# Altium schematic sheet CPU_LPC1776_1.SchDoc: RFSoC AMC
size 420 x 297 mm; CmpIndex: 51; CompanyName: WUT; DrawnBy: T. Przywozki; Organization: WUT ISE; Address1: Warsaw University of Technology; Address2: Nowowiejska 15/19 00-665 Warsaw; Address3: Tomasz.Przywozki@pw.edu.pl; DocumentNumber: 28; Revision: 1; SheetNumber: 28; SheetTotal: 45; Project: RFSoC AMC; ModifiedBy: T. Przywozki; CreateDate: -; CheckedDate: -; DivGrp: ISE; Designer: T. Przywozki; ModifiedDate: -; ProjectName: ADC/DAC MEZZANINE
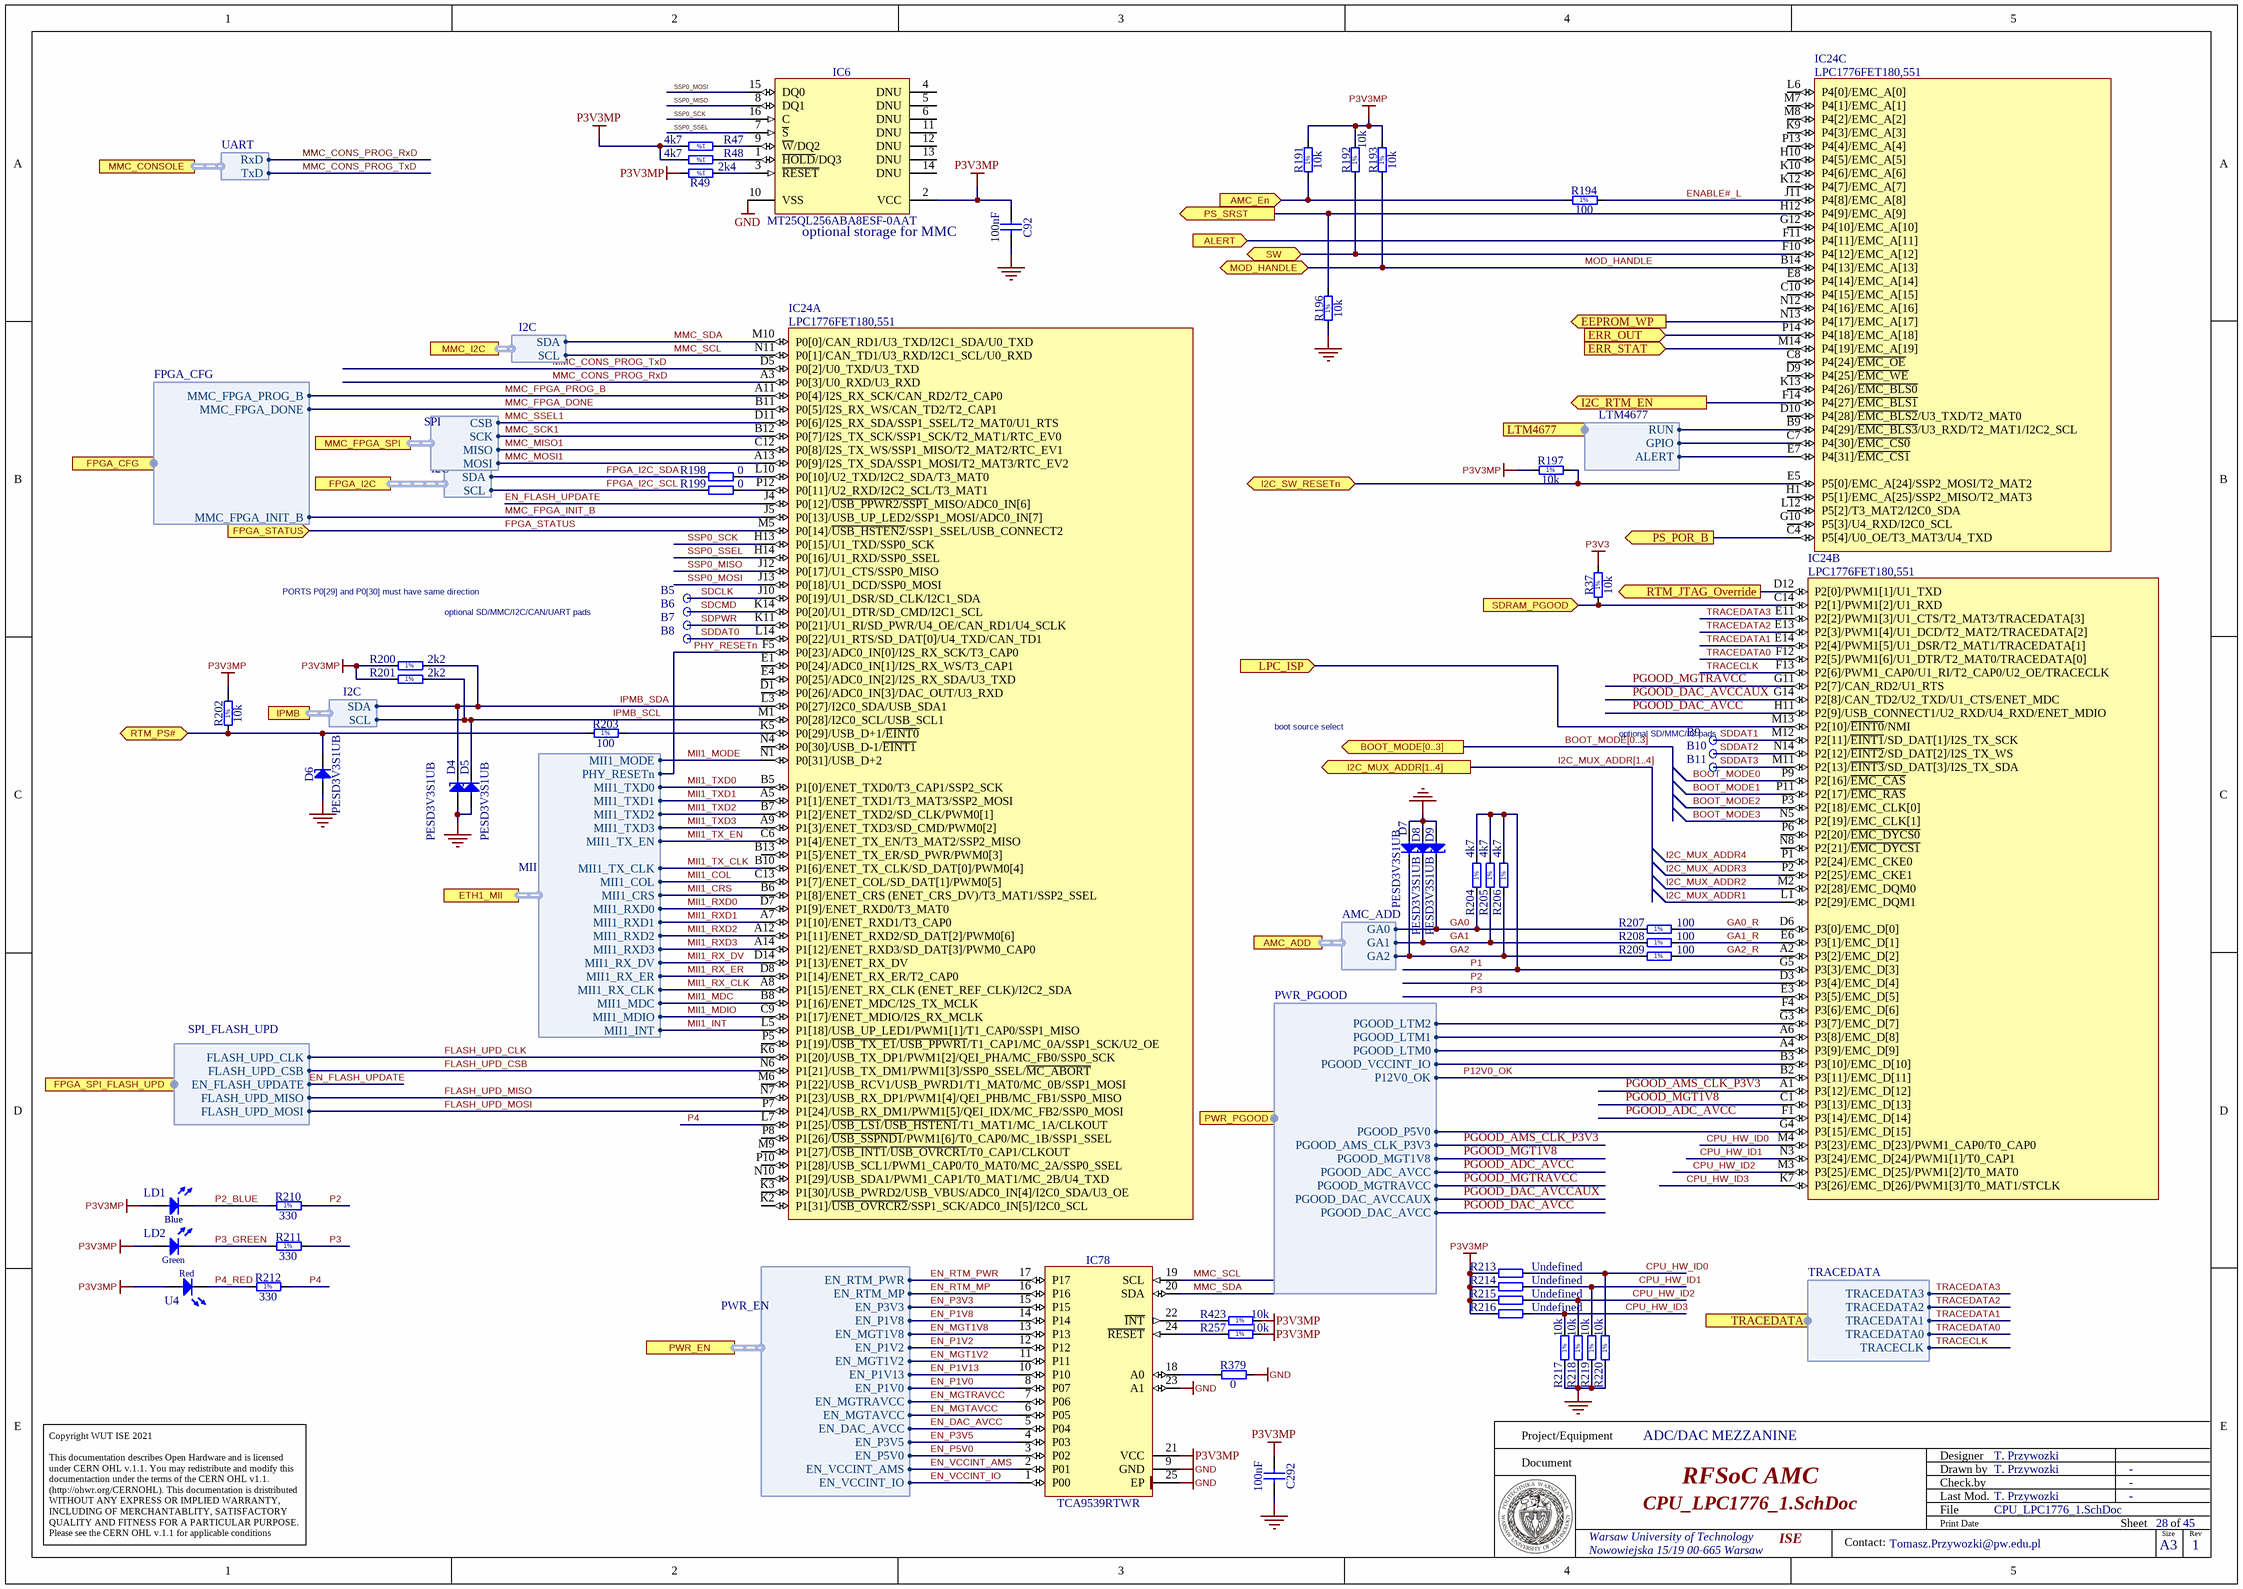
[diagram p0: CPU_LPC1776_1.SchDoc]

## Parts
B5  SMD_PAD_D1MM  [C100]  (value not drawn)
B6  SMD_PAD_D1MM  [C100]  (value not drawn)
B7  SMD_PAD_D1MM  [C100]  (value not drawn)
B8  SMD_PAD_D1MM  [C100]  (value not drawn)
B9  SMD_PAD_D1MM  [C100]  (value not drawn)
B10  SMD_PAD_D1MM  [C100]  (value not drawn)
B11  SMD_PAD_D1MM  [C100]  (value not drawn)
C92  100nF  [CAPC0603X33N]
C292  100nF  [CAPC0603X33N]
D4  PESD3V3S1UB  [SODFL1608X65N]
D5  PESD3V3S1UB  [SODFL1608X65N]
D6  PESD3V3S1UB  [SODFL1608X65N]
D7  PESD3V3S1UB  [SODFL1608X65N]
D8  PESD3V3S1UB  [SODFL1608X65N]
D9  PESD3V3S1UB  [SODFL1608X65N]
IC6  MT25QL256ABA8ESF-0AAT  [SOIC127P1030X265-16N]
IC24  LPC1776FET180,551  [BGA180C80P14X14_1200X1200X120]  (parts A,B,C of 5)
IC78  TCA9539RTWR  [QFN50P400X400X80-25N-S255]
LD1  Blue  [LED_AVAGO_HSMR-C120]
LD2  Green  [LED_AVAGO_HSME-C120]
R37  10k  [RESC1005X40N]
R47  4k7  [RESC1005X40N]
R48  4k7  [RESC1005X40N]
R49  2k4  [RESC1005X40N]
R191  10k  [RESC1005X40N]
R192  10k  [RESC1005X40N]
R193  10k  [RESC1005X40N]
R194  100  [RESC1005X40N]
R196  10k  [RESC1005X40N]
R197  10k  [RESC1005X40N]
R198  0  [RESC1005X40N]
R199  0  [RESC1005X40N]
R200  2k2  [RESC1005X40N]
R201  2k2  [RESC1005X40N]
R202  10k  [RESC1005X40N]
R203  100  [RESC1005X40N]
R204  4k7  [RESC1005X40N]
R205  4k7  [RESC1005X40N]
R206  4k7  [RESC1005X40N]
R207  100  [RESC1005X40N]
R208  100  [RESC1005X40N]
R209  100  [RESC1005X40N]
R210  330  [RESC1005X40N]
R211  330  [RESC1005X40N]
R212  330  [RESC1005X40N]
R213  Undefined  [RESC1005X40N]
R214  Undefined  [RESC1005X40N]
R215  Undefined  [RESC1005X40N]
R216  Undefined  [RESC1005X40N]
R217  10k  [RESC1005X40N]
R218  10k  [RESC1005X40N]
R219  10k  [RESC1005X40N]
R220  10k  [RESC1005X40N]
R257  10k  [RESC1005X40N]
R379  0  [RESC1005X40N]
R423  10k  [RESC1005X40N]
U4  Red  [LED_OSRAM_LS Q976]

## Ports
ALERT (in), AMC_ADD (harness AMC_ADD), AMC_En (in), BOOT_MODE[0..3] (out), EEPROM_WP (out), ERR_OUT (in), ERR_STAT (in), ETH1_MII (harness MII), FPGA_CFG (harness FPGA_CFG), FPGA_I2C (harness I2C), FPGA_SPI_FLASH_UPD (harness SPI_FLASH_UPD), FPGA_STATUS (in), I2C_MUX_ADDR[1..4] (out), I2C_RTM_EN (out), I2C_SW_RESETn (bidir), IPMB (harness I2C), LPC_ISP (in), LTM4677 (harness LTM4677), MMC_CONSOLE (harness UART), MMC_FPGA_SPI (harness SPI), MMC_I2C (harness I2C), MOD_HANDLE (bidir), PS_POR_B (out), PS_SRST (out), PWR_EN (harness PWR_EN), PWR_PGOOD (harness PWR_PGOOD), RTM_JTAG_Override (out), RTM_PS# (bidir), SDRAM_PGOOD (in), SW (bidir), TRACEDATA (harness TRACEDATA)

## Harnesses
I2C: SDA, SCL
MII: MII1_MODE, MII1_TXD0, MII1_TXD2, MII1_TXD3, MII1_TX_EN, MII1_TX_CLK, MII1_COL, MII1_CRS, MII1_RXD0, MII1_RXD1, MII1_RXD2, MII1_RXD3, MII1_RX_DV, MII1_RX_ER, MII1_RX_CLK, MII1_MDC, MII1_MDIO, MII1_INT, PHY_RESETn, MII1_TXD1
SPI: SCK, CSB, MISO, MOSI
FPGA_CFG: MMC_FPGA_PROG_B, MMC_FPGA_DONE, MMC_FPGA_INIT_B
AMC_ADD: GA0, GA1, GA2
SPI_FLASH_UPD: EN_FLASH_UPDATE, FLASH_UPD_MOSI, FLASH_UPD_MISO, FLASH_UPD_CSB, FLASH_UPD_CLK
PWR_PGOOD: PGOOD_AMS_CLK_P3V3, PGOOD_ADC_AVCC, PGOOD_MGT1V8, PGOOD_DAC_AVCCAUX, PGOOD_MGTRAVCC, PGOOD_DAC_AVCC, PGOOD_LTM0, PGOOD_LTM1, PGOOD_LTM2, P12V0_OK, PGOOD_P5V0, PGOOD_VCCINT_IO
PWR_EN: EN_MGTRAVCC, EN_MGT1V8, EN_DAC_AVCC, EN_P1V0, EN_P1V8, EN_P1V13, EN_MGT1V2, EN_P3V3, EN_P1V2, EN_P3V5, EN_MGTAVCC, EN_VCCINT_AMS, EN_RTM_PWR, EN_RTM_MP, EN_P5V0, EN_VCCINT_IO
LTM4677: GPIO, RUN, ALERT
UART: RxD, TxD
TRACEDATA: TRACEDATA3, TRACEDATA2, TRACEDATA1, TRACEDATA0, TRACECLK

## Nets
GND: C92.1 C292.1 D4.2(A) D5.2(A) D6.2(A) D7.2(A) D8.2(A) D9.2(A) IC6.10(VSS) IC78.9(GND) IC78.23(A1) IC78.25(EP) R196.1 R217.1 R218.1 R219.1 R220.1 R379.2
P3V3: R37.2
P3V3MP: C92.2 C292.2 IC6.2(VCC) IC78.21(VCC) LD1.2(A) LD2.2(A) R47.2 R48.2 R49.2 R191.2 R192.2 R193.2 R197.1 R200.1 R201.1 R202.2 R213.1 R214.1 R215.1 R216.1 R257.2 R423.2 U4.2(A)
ALERT: IC24.F11(P4[11]/EMC_A[11]) ; port ALERT
AMC_En: R191.1 R194.1 ; port AMC_En
BOOT_MODE0: IC24.P9(P2[16]/~{EMC_CAS})
BOOT_MODE1: IC24.P11(P2[17]/~{EMC_RAS})
BOOT_MODE2: IC24.P3(P2[18]/EMC_CLK[0])
BOOT_MODE3: IC24.N5(P2[19]/EMC_CLK[1])
CPU_HW_ID0: IC24.M4(P3[23]/EMC_D[23]/PWM1_CAP0/T0_CAP0) R213.2 R220.2
CPU_HW_ID1: IC24.N3(P3[24]/EMC_D[24]/PWM1[1]/T0_CAP1) R214.2 R219.2
CPU_HW_ID2: IC24.M3(P3[25]/EMC_D[25]/PWM1[2]/T0_MAT0) R215.2 R218.2
CPU_HW_ID3: IC24.K7(P3[26]/EMC_D[26]/PWM1[3]/T0_MAT1/STCLK) R216.2 R217.2
EEPROM_WP: IC24.N13(P4[17]/EMC_A[17]) ; port EEPROM_WP
EN_DAC_AVCC: IC78.5(P04) ; port PWR_EN.EN_DAC_AVCC
EN_FLASH_UPDATE: IC24.J4(P0[12]/~{USB_PPWR2/SSP1}_MISO/ADC0_IN[6]) ; port FPGA_SPI_FLASH_UPD.EN_FLASH_UPDATE
EN_MGT1V2: IC78.11(P11) ; port PWR_EN.EN_MGT1V2
EN_MGT1V8: IC78.13(P13) ; port PWR_EN.EN_MGT1V8
EN_MGTAVCC: IC78.6(P05) ; port PWR_EN.EN_MGTAVCC
EN_MGTRAVCC: IC78.7(P06) ; port PWR_EN.EN_MGTRAVCC
EN_P1V0: IC78.8(P07) ; port PWR_EN.EN_P1V0
EN_P1V2: IC78.12(P12) ; port PWR_EN.EN_P1V2
EN_P1V8: IC78.14(P14) ; port PWR_EN.EN_P1V8
EN_P1V13: IC78.10(P10) ; port PWR_EN.EN_P1V13
EN_P3V3: IC78.15(P15) ; port PWR_EN.EN_P3V3
EN_P3V5: IC78.4(P03) ; port PWR_EN.EN_P3V5
EN_P5V0: IC78.3(P02) ; port PWR_EN.EN_P5V0
EN_RTM_MP: IC78.16(P16) ; port PWR_EN.EN_RTM_MP
EN_RTM_PWR: IC78.17(P17) ; port PWR_EN.EN_RTM_PWR
EN_VCCINT_AMS: IC78.2(P01) ; port PWR_EN.EN_VCCINT_AMS
EN_VCCINT_IO: IC78.1(P00) ; port PWR_EN.EN_VCCINT_IO
ENABLE#_L: IC24.J11(P4[8]/EMC_A[8]) R194.2
ERR_OUT: IC24.P14(P4[18]/EMC_A[18]) ; port ERR_OUT
ERR_STAT: IC24.M14(P4[19]/EMC_A[19]) ; port ERR_STAT
FLASH_UPD_CLK: IC24.K6(P1[20]/USB_TX_DP1/PWM1[2]/QEI_PHA/MC_FB0/SSP0_SCK) ; port FPGA_SPI_FLASH_UPD.FLASH_UPD_CLK
FLASH_UPD_CSB: IC24.N6(P1[21]/USB_TX_DM1/PWM1[3]/SSP0_SSEL/~{MC_ABORT}) ; port FPGA_SPI_FLASH_UPD.FLASH_UPD_CSB
FLASH_UPD_MISO: IC24.N7(P1[23]/USB_RX_DP1/PWM1[4]/QEI_PHB/MC_FB1/SSP0_MISO) ; port FPGA_SPI_FLASH_UPD.FLASH_UPD_MISO
FLASH_UPD_MOSI: IC24.P7(P1[24]/USB_RX_DM1/PWM1[5]/QEI_IDX/MC_FB2/SSP0_MOSI) ; port FPGA_SPI_FLASH_UPD.FLASH_UPD_MOSI
FPGA_I2C_SCL: R199.1 ; port FPGA_I2C.SCL
FPGA_I2C_SDA: R198.1 ; port FPGA_I2C.SDA
FPGA_STATUS: IC24.M5(P0[14]/~{USB_HSTEN2}/SSP1_SSEL/USB_CONNECT2) ; port FPGA_STATUS
GA0: D9.1(C) R204.1 R207.1 ; port AMC_ADD.GA0
GA0_R: IC24.D6(P3[0]/EMC_D[0]) R207.2
GA1: D8.1(C) R205.1 R208.1 ; port AMC_ADD.GA1
GA1_R: IC24.E6(P3[1]/EMC_D[1]) R208.2
GA2: D7.1(C) R206.1 R209.1 ; port AMC_ADD.GA2
GA2_R: IC24.A2(P3[2]/EMC_D[2]) R209.2
I2C_MUX_ADDR1: IC24.L1(P2[29]/EMC_DQM1)
I2C_MUX_ADDR2: IC24.M2(P2[28]/EMC_DQM0)
I2C_MUX_ADDR3: IC24.P2(P2[25]/EMC_CKE1)
I2C_MUX_ADDR4: IC24.P1(P2[24]/EMC_CKE0)
I2C_RTM_EN: IC24.F14(P4[27]/~{EMC_BLS1}) ; port I2C_RTM_EN
I2C_SW_RESETn: IC24.E5(P5[0]/EMC_A[24]/SSP2_MOSI/T2_MAT2) R197.2 ; port I2C_SW_RESETn
IPMB_SCL: D5.1(C) IC24.M1(P0[28]/I2C0_SCL/USB_SCL1) R201.2 ; port IPMB.SCL
IPMB_SDA: D4.1(C) IC24.L3(P0[27]/I2C0_SDA/USB_SDA1) R200.2 ; port IPMB.SDA
LPC_ISP: IC24.M13(P2[10]/~{EINT0}/NMI) ; port LPC_ISP
MII1_COL: IC24.C13(P1[7]/ENET_COL/SD_DAT[1]/PWM0[5]) ; port ETH1_MII.MII1_COL
MII1_CRS: IC24.B6(P1[8]/ENET_CRS_(ENET_CRS_DV)/T3_MAT1/SSP2_SSEL) ; port ETH1_MII.MII1_CRS
MII1_INT: IC24.L5(P1[18]/USB_UP_LED1/PWM1[1]/T1_CAP0/SSP1_MISO) ; port ETH1_MII.MII1_INT
MII1_MDC: IC24.B8(P1[16]/ENET_MDC/I2S_TX_MCLK) ; port ETH1_MII.MII1_MDC
MII1_MDIO: IC24.C9(P1[17]/ENET_MDIO/I2S_RX_MCLK) ; port ETH1_MII.MII1_MDIO
MII1_MODE: IC24.N1(P0[31]/USB_D+2) ; port ETH1_MII.MII1_MODE
MII1_RX_CLK: IC24.A8(P1[15]/ENET_RX_CLK_(ENET_REF_CLK)/I2C2_SDA) ; port ETH1_MII.MII1_RX_CLK
MII1_RX_DV: IC24.D14(P1[13]/ENET_RX_DV) ; port ETH1_MII.MII1_RX_DV
MII1_RX_ER: IC24.D8(P1[14]/ENET_RX_ER/T2_CAP0) ; port ETH1_MII.MII1_RX_ER
MII1_RXD0: IC24.D7(P1[9]/ENET_RXD0/T3_MAT0) ; port ETH1_MII.MII1_RXD0
MII1_RXD1: IC24.A7(P1[10]/ENET_RXD1/T3_CAP0) ; port ETH1_MII.MII1_RXD1
MII1_RXD2: IC24.A12(P1[11]/ENET_RXD2/SD_DAT[2]/PWM0[6]) ; port ETH1_MII.MII1_RXD2
MII1_RXD3: IC24.A14(P1[12]/ENET_RXD3/SD_DAT[3]/PWM0_CAP0) ; port ETH1_MII.MII1_RXD3
MII1_TX_CLK: IC24.B10(P1[6]/ENET_TX_CLK/SD_DAT[0]/PWM0[4]) ; port ETH1_MII.MII1_TX_CLK
MII1_TX_EN: IC24.C6(P1[4]/ENET_TX_EN/T3_MAT2/SSP2_MISO) ; port ETH1_MII.MII1_TX_EN
MII1_TXD0: IC24.B5(P1[0]/ENET_TXD0/T3_CAP1/SSP2_SCK) ; port ETH1_MII.MII1_TXD0
MII1_TXD1: IC24.A5(P1[1]/ENET_TXD1/T3_MAT3/SSP2_MOSI) ; port ETH1_MII.MII1_TXD1
MII1_TXD2: IC24.B7(P1[2]/ENET_TXD2/SD_CLK/PWM0[1]) ; port ETH1_MII.MII1_TXD2
MII1_TXD3: IC24.A9(P1[3]/ENET_TXD3/SD_CMD/PWM0[2]) ; port ETH1_MII.MII1_TXD3
MMC_CONS_PROG_RxD: IC24.A3(P0[3]/U0_RXD/U3_RXD) ; port MMC_CONSOLE.RxD
MMC_CONS_PROG_TxD: IC24.D5(P0[2]/U0_TXD/U3_TXD) ; port MMC_CONSOLE.TxD
MMC_FPGA_DONE: IC24.B11(P0[5]/I2S_RX_WS/CAN_TD2/T2_CAP1) ; port FPGA_CFG.MMC_FPGA_DONE
MMC_FPGA_INIT_B: IC24.J5(P0[13]/USB_UP_LED2/SSP1_MOSI/ADC0_IN[7]) ; port FPGA_CFG.MMC_FPGA_INIT_B
MMC_FPGA_PROG_B: IC24.A11(P0[4]/I2S_RX_SCK/CAN_RD2/T2_CAP0) ; port FPGA_CFG.MMC_FPGA_PROG_B
MMC_MISO1: IC24.C12(P0[8]/I2S_TX_WS/SSP1_MISO/T2_MAT2/RTC_EV1) ; port MMC_FPGA_SPI.MISO
MMC_MOSI1: IC24.A13(P0[9]/I2S_TX_SDA/SSP1_MOSI/T2_MAT3/RTC_EV2) ; port MMC_FPGA_SPI.MOSI
MMC_SCK1: IC24.B12(P0[7]/I2S_TX_SCK/SSP1_SCK/T2_MAT1/RTC_EV0) ; port MMC_FPGA_SPI.SCK
MMC_SCL: IC24.N11(P0[1]/CAN_TD1/U3_RXD/I2C1_SCL/U0_RXD) IC78.19(SCL) ; port MMC_I2C.SCL
MMC_SDA: IC24.M10(P0[0]/CAN_RD1/U3_TXD/I2C1_SDA/U0_TXD) IC78.20(SDA) ; port MMC_I2C.SDA
MMC_SSEL1: IC24.D11(P0[6]/I2S_RX_SDA/SSP1_SSEL/T2_MAT0/U1_RTS) ; port MMC_FPGA_SPI.CSB
MOD_HANDLE: IC24.B14(P4[13]/EMC_A[13]) R193.1 ; port MOD_HANDLE
P1: IC24.G5(P3[3]/EMC_D[3]) R204.2 R205.2 R206.2
P2: IC24.D3(P3[4]/EMC_D[4]) R210.2
P2_BLUE: LD1.1(C) R210.1
P3: IC24.E3(P3[5]/EMC_D[5]) R211.2
P3_GREEN: LD2.1(C) R211.1
P4: IC24.L7(P1[25]/~{USB_LS1}/~{USB_HSTEN1}/T1_MAT1/MC_1A/CLKOUT) R212.2
P4_RED: R212.1 U4.1(C)
P12V0_OK: IC24.B2(P3[11]/EMC_D[11]) ; port PWR_PGOOD.P12V0_OK
PGOOD_ADC_AVCC: IC24.F1(P3[14]/EMC_D[14]) ; port PWR_PGOOD.PGOOD_ADC_AVCC
PGOOD_AMS_CLK_P3V3: IC24.A1(P3[12]/EMC_D[12]) ; port PWR_PGOOD.PGOOD_AMS_CLK_P3V3
PGOOD_DAC_AVCC: IC24.H11(P2[9]/USB_CONNECT1/U2_RXD/U4_RXD/ENET_MDIO) ; port PWR_PGOOD.PGOOD_DAC_AVCC
PGOOD_DAC_AVCCAUX: IC24.G14(P2[8]/CAN_TD2/U2_TXD/U1_CTS/ENET_MDC) ; port PWR_PGOOD.PGOOD_DAC_AVCCAUX
PGOOD_MGT1V8: IC24.C1(P3[13]/EMC_D[13]) ; port PWR_PGOOD.PGOOD_MGT1V8
PGOOD_MGTRAVCC: IC24.G11(P2[7]/CAN_RD2/U1_RTS) ; port PWR_PGOOD.PGOOD_MGTRAVCC
PHY_RESETn: IC24.F5(P0[23]/ADC0_IN[0]/I2S_RX_SCK/T3_CAP0) ; port ETH1_MII.PHY_RESETn
PS_POR_B: IC24.C4(P5[4]/U0_OE/T3_MAT3/U4_TXD) ; port PS_POR_B
PS_SRST: IC24.H12(P4[9]/EMC_A[9]) R196.2 ; port PS_SRST
RTM_JTAG_Override: IC24.D12(P2[0]/PWM1[1]/U1_TXD) ; port RTM_JTAG_Override
RTM_PS#: D6.1(C) R202.1 R203.1 ; port RTM_PS#
SDCLK: B5.1 IC24.J10(P0[19]/U1_DSR/SD_CLK/I2C1_SDA)
SDCMD: B6.1 IC24.K14(P0[20]/U1_DTR/SD_CMD/I2C1_SCL)
SDDAT0: B8.1 IC24.L14(P0[22]/U1_RTS/SD_DAT[0]/U4_TXD/CAN_TD1)
SDDAT1: B9.1 IC24.M12(P2[11]/~{EINT1}/SD_DAT[1]/I2S_TX_SCK)
SDDAT2: B10.1 IC24.N14(P2[12]/~{EINT2}/SD_DAT[2]/I2S_TX_WS)
SDDAT3: B11.1 IC24.M11(P2[13]/~{EINT3}/SD_DAT[3]/I2S_TX_SDA)
SDPWR: B7.1 IC24.K11(P0[21]/U1_RI/SD_PWR/U4_OE/CAN_RD1/U4_SCLK)
SDRAM_PGOOD: IC24.C14(P2[1]/PWM1[2]/U1_RXD) R37.1 ; port SDRAM_PGOOD
SSP0_MISO: IC6.8(DQ1) IC24.J12(P0[17]/U1_CTS/SSP0_MISO)
SSP0_MOSI: IC6.15(DQ0) IC24.J13(P0[18]/U1_DCD/SSP0_MOSI)
SSP0_SCK: IC6.16(C) IC24.H13(P0[15]/U1_TXD/SSP0_SCK)
SSP0_SSEL: IC6.7(~{S}) IC24.H14(P0[16]/U1_RXD/SSP0_SSEL)
SW: IC24.F10(P4[12]/EMC_A[12]) R192.1 ; port SW
TRACECLK: IC24.F13(P2[6]/PWM1_CAP0/U1_RI/T2_CAP0/U2_OE/TRACECLK) ; port TRACEDATA.TRACECLK
TRACEDATA0: IC24.F12(P2[5]/PWM1[6]/U1_DTR/T2_MAT0/TRACEDATA[0]) ; port TRACEDATA.TRACEDATA0
TRACEDATA1: IC24.E14(P2[4]/PWM1[5]/U1_DSR/T2_MAT1/TRACEDATA[1]) ; port TRACEDATA.TRACEDATA1
TRACEDATA2: IC24.E13(P2[3]/PWM1[4]/U1_DCD/T2_MAT2/TRACEDATA[2]) ; port TRACEDATA.TRACEDATA2
TRACEDATA3: IC24.E11(P2[2]/PWM1[3]/U1_CTS/T2_MAT3/TRACEDATA[3]) ; port TRACEDATA.TRACEDATA3
NetIC6_1: IC6.1(~{HOLD}/DQ3) R48.1
NetIC6_3: IC6.3(~{RESET}) R49.1
NetIC6_9: IC6.9(~{W}/DQ2) R47.1
NetIC24_A4: IC24.A4(P3[9]/EMC_D[9]) ; port PWR_PGOOD.PGOOD_LTM0
NetIC24_A6: IC24.A6(P3[8]/EMC_D[8]) ; port PWR_PGOOD.PGOOD_LTM1
NetIC24_B3: IC24.B3(P3[10]/EMC_D[10]) ; port PWR_PGOOD.PGOOD_VCCINT_IO
NetIC24_B9: IC24.B9(P4[29]/~{EMC_BLS3}/U3_RXD/T2_MAT1/I2C2_SCL) ; port LTM4677.RUN
NetIC24_C7: IC24.C7(P4[30]/~{EMC_CS0}) ; port LTM4677.GPIO
NetIC24_E7: IC24.E7(P4[31]/~{EMC_CS1}) ; port LTM4677.ALERT
NetIC24_G3: IC24.G3(P3[7]/EMC_D[7]) ; port PWR_PGOOD.PGOOD_LTM2
NetIC24_G4: IC24.G4(P3[15]/EMC_D[15]) ; port PWR_PGOOD.PGOOD_P5V0
NetIC24_K5: IC24.K5(P0[29]/USB_D+1/~{EINT0}) R203.2
NetIC24_L10: IC24.L10(P0[10]/U2_TXD/I2C2_SDA/T3_MAT0) R198.2
NetIC24_P12: IC24.P12(P0[11]/U2_RXD/I2C2_SCL/T3_MAT1) R199.2
NetIC78_18: IC78.18(A0) R379.1
NetIC78_22: IC78.22(~{INT}) R423.1
NetIC78_24: IC78.24(~{RESET}) R257.1

Not connected (* = marked no-connect by the designer): IC6 4(DNU) 5(DNU) 6(DNU) 11(DNU) 12(DNU) 13(DNU) 14(DNU); IC24 B13(P1[5]/ENET_TX_ER/SD_PWR/PWM0[3]) C8(P4[24]/~{EMC_OE}) C10(P4[15]/EMC_A[15]) D1(P0[26]/ADC0_IN[3]/DAC_OUT/U3_RXD) D9(P4[25]/~{EMC_WE}) D10(P4[28]/~{EMC_BLS2}/U3_TXD/T2_MAT0) E1(P0[24]/ADC0_IN[1]/I2S_RX_WS/T3_CAP1) E4(P0[25]/ADC0_IN[2]/I2S_RX_SDA/U3_TXD) E8(P4[14]/EMC_A[14]) F4(P3[6]/EMC_D[6]) G10(P5[3]/U4_RXD/I2C0_SCL) G12(P4[10]/EMC_A[10]) H1(P5[1]/EMC_A[25]/SSP2_MISO/T2_MAT3) H10(P4[5]/EMC_A[5]) K2(P1[31]/~{USB_OVRCR2}/SSP1_SCK/ADC0_IN[5]/I2C0_SCL) K3(P1[30]/USB_PWRD2/USB_VBUS/ADC0_IN[4]/I2C0_SDA/U3_OE) K9(P4[3]/EMC_A[3]) K10(P4[6]/EMC_A[6]) K12(P4[7]/EMC_A[7]) K13(P4[26]/~{EMC_BLS0}) L6(P4[0]/EMC_A[0]) L12(P5[2]/T3_MAT2/I2C0_SDA) M6(P1[22]/USB_RCV1/USB_PWRD1/T1_MAT0/MC_0B/SSP1_MOSI) M7(P4[1]/EMC_A[1]) M8(P4[2]/EMC_A[2]) M9(P1[27]/~{USB_INT1}/~{USB_OVRCR1}/T0_CAP1/CLKOUT) N4(P0[30]/USB_D-1/~{EINT1}) N8(P2[21]/~{EMC_DYCS1}) N10(P1[29]/USB_SDA1/PWM1_CAP1/T0_MAT1/MC_2B/U4_TXD) N12(P4[16]/EMC_A[16]) P5(P1[19]/~{USB_TX_E1}/~{USB_PPWR1}/T1_CAP1/MC_0A/SSP1_SCK/U2_OE) P6(P2[20]/~{EMC_DYCS0}) P8(P1[26]/~{USB_SSPND1}/PWM1[6]/T0_CAP0/MC_1B/SSP1_SSEL) P10(P1[28]/USB_SCL1/PWM1_CAP0/T0_MAT0/MC_2A/SSP0_SSEL) P13(P4[4]/EMC_A[4])

## Buses and harness runs
bus BOOT_MODE[0..3] = port BOOT_MODE[0..3]
bus I2C_MUX_ADDR[1..4] = port I2C_MUX_ADDR[1..4]

## Notes on the sheet
- optional storage for MMC
- PORTS P0[29] and P0[30] must have same direction
- optional SD/MMC/I2C/CAN/UART pads
- boot source select
- (near B9) optional SD/MMC/IO pads
- Project/Equipment
- Document
- Designer
- Drawn by
- Check.by
- Copyright WUT ISE 2021
  This documentation describes Open Hardware and is licensed under CERN OHL v.1.1. You may redistribute and modify this documentaction under the terms of the CERN OHL v1.1.
  (http://ohwr.org/CERNOHL). This documentation is dristributed WITHOUT ANY EXPRESS OR IMPLIED WARRANTY, INCLUDING OF MERCHANTABLITY, SATISFACTORY QUALITY AND FITNESS FOR A PARTICULAR PURPOSE. Please see the CERN OHL v.1.1 for applicable conditions
- File
- Last Mod.
- Print Date
- Sheet
- Size
- A3
- of
- Rev
- Contact:
- (in symbol R0402_2K2_1%_0.0625W_100PPM) 1%
- (in symbol R0402_2K4_1%_0.0625W_100PPM) 1%
- (in symbol R0402_4K7_1%_0.0625W_100PPM) 1%
- (in symbol R0402_10K_1%_0.0625W_100PPM) 1%
- (in symbol R0402_100R_1%_0.1W_100PPM) 1%
- (in symbol R0402_330R_1%_0.0625W_100PPM) 1%

## Library data of the parts
B5-B11 = C100: $$NotCommonProperty_Partition: Pads; Part Description: 1mm Diameter SMD Pad; $$Internal_Resolution: 00001mm; $$NotCommonProperty_Family: SMD Pad; $$NotCommonProperty_Mounted: No; $$NotCommonProperty_Pin Count: 1; $$NotCommonProperty_Sense: No; $$NotCommonProperty_Status: None; CmpIndex: 236; Ref Designator: B5; SymIndex: 2108; $$NotCommonProperty_ComponentHeight: 0mm; $$NotCommonProperty_Footprint Ref: C100; $$NotCommonProperty_SMD: No; $$NotCommonProperty_Socket: No; Cell Name: C100; PackageDescription: 1mm Diameter SMD Pad; Part Name: SMD_PAD_D1MM; Part Number: SMD_PAD_D1MM; Orientation: 0 = 0
C92 C292 = CC0201_100NF_6.3V_10%_X5R: Non-polarised capacitor; Manufacturer: GENERIC; Part Description: SMD Multilayer Chip Ceramic Capacitor; Manufacturer1 Part Number: 02016D104KAT2A; Tolerance: ±10%; Voltage: 6.3V; TC: X5R; Manufacturer Part Number: CC0201_100NF_6.3V_10%_X5R; Part Number: CC0201_100NF_6.3V_10%_X5R; Value: 100nF; Component Kind: Standard; Component Type: Standard; Pin Count: 2; Status: Not Recommended; Case: 0201; Mounted: Yes; Socket: No; SMD: Yes; Sense: No; Manufacturer1 Example: AVX; Manufacturer1 ComponentHeight: 0.33mm; HelpURL: \\cern.ch\dfs\Applications\Altium\Datasheets\CC0201_X5R_AVX.pdf; Author: CERN DEM JLC; CreateDate: 03.12.2007; LatestRevisionDate: 03.12.2007
D4-D9 = PESD3V3S1UB: ESD protection diode; Manufacturer: NXP SEMICONDUCTORS; Part Description: ESD protection diode (23kV); Voltage: 3V3; Power: 330W; PressFit: No; Bonding: No; Manufacturer Part Number: PESD3V3S1UB; PackageDescription: Ultra Small Outline Diode Flat Lead (SOD-523), Body; 1.2mm L X 0.8mm W X 0.65mm H, IPC Medium Density; Part Number: PESD3V3S1UB; Component Kind: Standard; Component Type: Standard; Device: PESD3V3S1UB; Pin Count: 2; Case: SOD523; Mounted: Yes; Socket: No; SMD: Yes; Sense: No; ComponentHeight: 0.65mm; HelpURL: \\cern.ch\dfs\Applications\Altium\Datasheets\PESD3V3S1UB.pdf; Author: CERN DEM JLC; CreateDate: 29.11.2012; LatestRevisionDate: 29.11.2012
IC6 = MT25QL256ABA8ESF-0AAT: 256Mbit (32MB), 2.7V-3.6V, Multiple I/O Serial NOR Flash Memory,with Reset# & Hold#; Part Description: 256Mbit (32MB), 2.7V-3.6V, Multiple I/O Serial NOR Flash Memory,with Reset# & Hold# (Automotive grade AEC-Q100); Manufacturer: MICRON TECHNOLOGY; PressFit: No; Bonding: No; Part Number: MT25QL256ABA8ESF-0AAT; Component Kind: Standard; Component Type: Standard; Device: MT25QL256ABA8ESF-0AAT; PackageDescription: SOIC 16, Pitch 1.27mm - Body 7.5x10.3mm, IPC Medium Density; Manufacturer Part Number: MT25QL256ABA8ESF-0AAT; Pin Count: 16; Case: SOIC16; Mounted: Yes; Socket: No; SMD: Yes; Sense: No; ComponentHeight: 2.65mm; HelpURL: \\cern.ch\dfs\Applications\Altium\Datasheets\MT25QL256ABA8ESF-0AAT.pdf; Author: CERN DEM JLC; CreateDate: 05.11.2018; LatestRevisionDate: 05.11.2018
IC24 = LPC1776FET180,551: 32-bit ARM Cortex-M3 MCU, 256kB Flash, 80kB SRAM, Ethernet, USB 2.0 Device/Host/OTG, CAN, 12-Bit ADC; Manufacturer: NXP SEMICONDUCTORS; Part Description: Cortex-M3, 32-bit ARM MCU, 256kB Flash, 80kB SRAM, Ethernet, USB 2.0 Device/Host/OTG, CAN, 12-Bit ADC; PressFit: No; Bonding: No; Manufacturer Part Number: LPC1776FET180,551; PackageDescription: BGA, 0.80mm Pitch, Square; 180 Pin, 14 Columns X 14 Rows, Body 12.00mm X 12.00mm X 1.20mm H, IPC Medium Density; Part Number: LPC1776FET180,551; Component Kind: Standard; Component Type: Standard; Device: LPC1776FET180,551; Pin Count: 180; Case: BGA180; Mounted: Yes; Socket: No; SMD: Yes; Sense: No; ComponentHeight: 1.2mm; HelpURL: \\cern.ch\dfs\Applications\Altium\Datasheets\LPC1776FET180,551.pdf; Author: CERN DEM JMW; CreateDate: 16.08.2016; LatestRevisionDate: 16.08.2016
IC78 = TCA9539RTWR: Low-Voltage 16-Bit I2C and SMBus I/O Expander; Manufacturer: TEXAS INSTRUMENTS; Part Description: Low Voltage 16-Bit I2C and SMBus Low-Power I/O Expander With Interrupt Output, Reset Pin, Configuration Registers; PressFit: No; Bonding: No; Manufacturer Part Number: TCA9539RTWR; PackageDescription: QFN, 0.50mm Pitch, Square; 24 Pin, 4.00mm X 4.00mm X 0.80mm H Body (w/Thermal Tab 2.55 X 2.55 mm), IPC Medium Density; Part Number: TCA9539RTWR; Component Kind: Standard; Component Type: Standard; Device: TCA9539RTWR; Pin Count: 25; Case: QFN24; Mounted: Yes; Socket: No; SMD: Yes; Sense: No; ComponentHeight: 0.8mm; Author: CERN DEM MR; HelpURL: \\cern.ch\dfs\Applications\Altium\Datasheets\TCA9539RTWR.pdf; CreateDate: 01.12.2015; LatestRevisionDate: 01.12.2015
LD1 = LED_AVAGO_HSMR-C120: LED Blue 1C 2A; Manufacturer: AVAGO TECHNOLOGIES; Part Description: High Performance Right Angle Chip InGaN Blue LED; PressFit: No; Bonding: No; Manufacturer Part Number: HSMR-C120; PackageDescription: Blue Chip LED, 2-Leads, Body 1.7x1.1mm, Side Emitting Package; Part Number: LED_AVAGO_HSMR-C120; Component Kind: Standard; Component Type: Standard; Color: Blue; Pin Count: 2; Mounted: Yes; Socket: No; SMD: Yes; Sense: No; ComponentHeight: 0.7mm; HelpURL: \\cern.ch\dfs\Applications\Altium\Datasheets\LED_AVAGO_HSMR-C120.pdf; Author: CERN DEM JLC; CreateDate: 07.07.2014; LatestRevisionDate: 07.07.2014
LD2 = LED_AVAGO_HSME-C120: LED Green 1C 2A; Manufacturer: AVAGO TECHNOLOGIES; Part Description: High Performance Right Angle Chip Green LED; PressFit: No; Bonding: No; Manufacturer Part Number: HSME-C120; PackageDescription: Green Chip LED, 2-Leads, Body 1.7x1.1mm, Side Emitting Package; Part Number: LED_AVAGO_HSME-C120; Component Kind: Standard; Component Type: Standard; Color: Green; Pin Count: 2; Mounted: Yes; Socket: No; SMD: Yes; Sense: No; ComponentHeight: 0.7mm; HelpURL: \\cern.ch\dfs\Applications\Altium\Datasheets\LED_AVAGO_HSME-C120.pdf; ComponentLink1URL: \\cern.ch\dfs\Applications\Altium\Datasheets\LED_AVAGO_HSME-C110_DESIGN-GUIDE.pdf; ComponentLink1Description: Design Guide; Author: CERN DEM JMW; CreateDate: 22.07.2009; LatestRevisionDate: 20.06.2012
R37 R191-R193 R196 R197 R202 R217-R220 R257 R423 = R0402_10K_1%_0.0625W_100PPM: Resistor - 1%; Manufacturer: GENERIC; Part Description: General Purpose Thick Film Chip Resistor; Manufacturer1 Part Number: 232270671003L; TC: ±100ppm/°C; PressFit: No; Manufacturer Part Number: R0402_10K_1%_0.0625W_100PPM; Part Number: R0402_10K_1%_0.0625W_100PPM; Tolerance: ±1%; Value: 10k; Component Kind: Standard; Component Type: Standard; Pin Count: 2; Status: Not Recommended; Power: 0.0625W; Case: 0402; Mounted: Yes; Sense: No; Socket: No; SMD: Yes; Manufacturer1 Example: YAGEO PHYCOMP; Manufacturer1 ComponentHeight: 0.4mm; HelpURL: \\cern.ch\dfs\Applications\Altium\Datasheets\R0402_Phycomp_RC0402.pdf; Author: CERN DEM JLC
  R37: CreateDate: 03/12/2007; LatestRevisionDate: 17/10/2012
  R191-R193 R196 R197 R202 R217-R220 R257 R423: CreateDate: 03.12.2007; LatestRevisionDate: 17.10.2012
R47 R48 R204-R206 = R0402_4K7_1%_0.0625W_100PPM: Resistor - 1%; Manufacturer: GENERIC; Part Description: General Purpose Thick Film Chip Resistor; Manufacturer1 Part Number: 232270674702L; TC: ±100ppm/°C; PressFit: No; Manufacturer Part Number: R0402_4K7_1%_0.0625W_100PPM; Part Number: R0402_4K7_1%_0.0625W_100PPM; Tolerance: ±1%; Value: 4k7; Component Kind: Standard; Component Type: Standard; Pin Count: 2; Status: Not Recommended; Power: 0.0625W; Case: 0402; Mounted: Yes; Sense: No; Socket: No; SMD: Yes; Manufacturer1 Example: YAGEO PHYCOMP; Manufacturer1 ComponentHeight: 0.4mm; HelpURL: \\cern.ch\dfs\Applications\Altium\Datasheets\R0402_Phycomp_RC0402.pdf; Author: CERN DEM JLC; CreateDate: 03.12.2007; LatestRevisionDate: 17.10.2012
R49 = R0402_2K4_1%_0.0625W_100PPM: Resistor - 1%; Manufacturer: GENERIC; Part Description: General Purpose Thick Film Chip Resistor; Manufacturer1 Part Number: 232270672402L; TC: ±100ppm/°C; PressFit: No; Manufacturer Part Number: R0402_2K4_1%_0.0625W_100PPM; Part Number: R0402_2K4_1%_0.0625W_100PPM; Tolerance: ±1%; Value: 2k4; Component Kind: Standard; Component Type: Standard; Pin Count: 2; Status: Not Recommended; Power: 0.0625W; Case: 0402; Mounted: Yes; Sense: No; Socket: No; SMD: Yes; Manufacturer1 Example: YAGEO PHYCOMP; Manufacturer1 ComponentHeight: 0.4mm; HelpURL: \\cern.ch\dfs\Applications\Altium\Datasheets\R0402_Phycomp_RC0402.pdf; Author: CERN DEM JLC; CreateDate: 03.12.2007; LatestRevisionDate: 17.10.2012
R194 R203 R207-R209 = R0402_100R_1%_0.1W_100PPM: Resistor - 1%; Manufacturer Part Number: R0402_100R_1%_0.1W_100PPM_50V; Manufacturer: GENERIC; Part Description: General Purpose Thick Film Chip Resistor; Manufacturer1 Part Number: ERJ2RKF1000X; Power: 0.1W; TC: ±100ppm/°C; Voltage: 50V; PressFit: No; Part Number: R0402_100R_1%_0.1W_100PPM; Tolerance: ±1%; Value: 100; Component Kind: Standard; Component Type: Standard; Pin Count: 2; Status: Not Recommended; Case: 0402; Mounted: Yes; Sense: No; Socket: No; SMD: Yes; Manufacturer1 Example: PANASONIC; Manufacturer1 ComponentHeight: 0.4mm; HelpURL: \\cern.ch\dfs\Applications\Altium\Datasheets\R0402_PANASONIC_ERJ2RK.pdf; Author: CERN DEM JLC; CreateDate: 12.12.2013; LatestRevisionDate: 03.03.2015
R198 R199 = R0402_0R_JUMPER: Resistor; Manufacturer: GENERIC; Part Description: 1A (0.05R Max DC Resistance) Zero Ohm Jumper; Manufacturer1 Part Number: 232270591001L; PressFit: No; Manufacturer Part Number: R0402_0R_JUMPER; Part Number: R0402_0R_JUMPER; Value: 0; Component Kind: Standard; Component Type: Standard; Pin Count: 2; Status: Not Recommended; Case: 0402; Mounted: Yes; Sense: No; Socket: No; SMD: Yes; Manufacturer1 Example: YAGEO PHYCOMP; Manufacturer1 ComponentHeight: 0.4mm; HelpURL: \\cern.ch\dfs\Applications\Altium\Datasheets\R0402_Phycomp_RC0402.pdf; Author: CERN DEM JLC; CreateDate: 03.12.2007; LatestRevisionDate: 17.10.2012
R200 R201 = R0402_2K2_1%_0.0625W_100PPM: Resistor - 1%; Manufacturer: GENERIC; Part Description: General Purpose Thick Film Chip Resistor; Manufacturer1 Part Number: 232270672202L; TC: ±100ppm/°C; PressFit: No; Manufacturer Part Number: R0402_2K2_1%_0.0625W_100PPM; Part Number: R0402_2K2_1%_0.0625W_100PPM; Tolerance: ±1%; Value: 2k2; Component Kind: Standard; Component Type: Standard; Pin Count: 2; Status: Not Recommended; Power: 0.0625W; Case: 0402; Mounted: Yes; Sense: No; Socket: No; SMD: Yes; Manufacturer1 Example: YAGEO PHYCOMP; Manufacturer1 ComponentHeight: 0.4mm; HelpURL: \\cern.ch\dfs\Applications\Altium\Datasheets\R0402_Phycomp_RC0402.pdf; Author: CERN DEM JLC; CreateDate: 03.12.2007; LatestRevisionDate: 17.10.2012
R210-R212 = R0402_330R_1%_0.0625W_100PPM: Resistor - 1%; Manufacturer: GENERIC; Part Description: General Purpose Thick Film Chip Resistor; Manufacturer1 Part Number: 232270673301L; TC: ±100ppm/°C; PressFit: No; Manufacturer Part Number: R0402_330R_1%_0.0625W_100PPM; Part Number: R0402_330R_1%_0.0625W_100PPM; Tolerance: ±1%; Value: 330; Component Kind: Standard; Component Type: Standard; Pin Count: 2; Status: Not Recommended; Power: 0.0625W; Case: 0402; Mounted: Yes; Sense: No; Socket: No; SMD: Yes; Manufacturer1 Example: YAGEO PHYCOMP; Manufacturer1 ComponentHeight: 0.4mm; HelpURL: \\cern.ch\dfs\Applications\Altium\Datasheets\R0402_Phycomp_RC0402.pdf; Author: CERN DEM JLC; CreateDate: 03.12.2007; LatestRevisionDate: 17.10.2012
R213-R216 = R0402_NO-VALUE: Resistor; Part Description: Reserved Footprint For a 0402 (1005) Chip Resistor; PressFit: No; Mounted: No; Part Number: R0402_NO-VALUE; Component Kind: Standard; Component Type: Standard; Pin Count: 2; Value: Undefined; Status: None; Manufacturer: Undefined; Manufacturer Part Number: R0402_NO-VALUE; Case: 0402; Sense: No; Socket: No; SMD: Yes; Manufacturer1 Example: Undefined; Manufacturer1 Part Number: Undefined; Manufacturer1 ComponentHeight: Undefined; HelpURL: Undefined; Author: CERN DEM JLC; CreateDate: 03.12.2007; LatestRevisionDate: 13.03.2008
R379 = R0402_0R_JUMPER: Resistor; Part Description: 1A (0.05R Max DC Resistance) Zero Ohm Jumper; Manufacturer: GENERIC; Manufacturer1 Part Number: 232270591001L; PressFit: No; Part Number: R0402_0R_JUMPER; Component Kind: Standard; Component Type: Standard; Pin Count: 2; Value: 0; Status: Not Recommended; Manufacturer Part Number: R0402_0R_JUMPER; Case: 0402; Mounted: Yes; Sense: No; Socket: No; SMD: Yes; Manufacturer1 Example: YAGEO PHYCOMP; Manufacturer1 ComponentHeight: 0.4mm; HelpURL: \\cern.ch\dfs\Applications\Altium\Datasheets\R0402_Phycomp_RC0402.pdf; Author: CERN DEM JLC; CreateDate: 03.12.2007; LatestRevisionDate: 17.10.2012
U4 = LED_OSRAM_LS Q976-NR-1: LED Red 1C 2A; Manufacturer: OSRAM; Part Description: CHIPLED Super Red LED (0603 Case); PressFit: No; Bonding: No; Manufacturer Part Number: LS Q976-NR-1; PackageDescription: Chip Super Red LED, 2-Leads, Body 1.6x0.8mm; Part Number: LED_OSRAM_LS Q976-NR-1; Component Kind: Standard; Component Type: Standard; Color: Red; Pin Count: 2; Case: 0806; Mounted: Yes; Socket: No; SMD: Yes; Sense: No; ComponentHeight: 0.8mm; HelpURL: \\cern.ch\dfs\Applications\Altium\Datasheets\LED_OSRAM_LS Q976-NR-1.pdf; Author: CERN DEM JLC; CreateDate: 12.11.2014; LatestRevisionDate: 12.11.2014